# Altium schematic sheet CANBUS.SchDoc
size A3; SheetNumber: 11; SheetTotal: 11
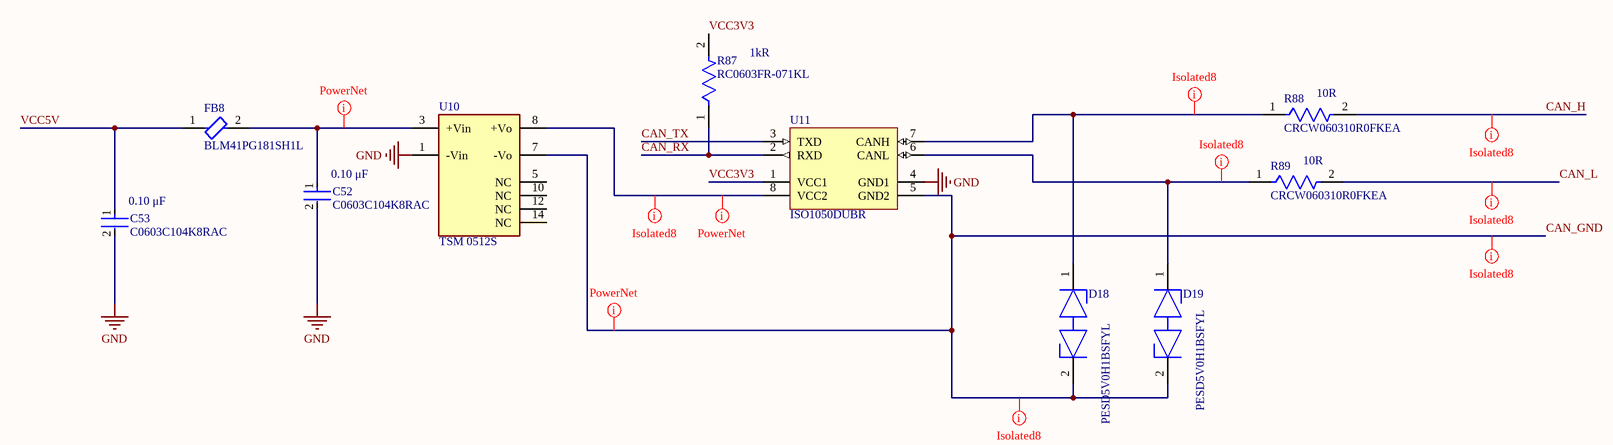
[diagram p0: CANBUS.SchDoc]

## Parts
C52  C0603C104K8RAC  Capacitance: 0.10 μF  [FP-C0603C-CF-MFG]
C53  C0603C104K8RAC  Capacitance: 0.10 μF  [FP-C0603C-CF-MFG]
D18  PESD5V0H1BSFYL  [FP-SOD962-2-MFG]
D19  PESD5V0H1BSFYL  [FP-SOD962-2-MFG]
FB8  BLM41PG181SH1L  [FP-BLM41-0_2-a1_2-MFG]
R87  RC0603FR-071KL  Resistance: 1kR  [FP-RC0603-0_55-IPC_C]
R88  CRCW060310R0FKEA  Resistance: 10R  [FP-CRCW0603-e3-IPC_A]
R89  CRCW060310R0FKEA  Resistance: 10R  [FP-CRCW0603-e3-IPC_A]
U10  TSM 0512S  [FP-TSM_0512S-MFG]
U11  ISO1050DUBR  [DUB0008A_L]

## Nets
GND: C52.2 C53.2 U10.1(-Vin) U11.4(GND1)
CAN_GND: D18.2(K2) D19.2(K2) U10.7(-Vo) U11.5(GND2)
CAN_H: R88.2
CAN_L: R89.2
CAN_RX: R87.1 U11.2(RXD)
CAN_TX: U11.3(TXD)
VCC3V3: R87.2 U11.1(VCC1)
VCC5V: C53.1 FB8.1
NetC52_1: C52.1 FB8.2 U10.3(+Vin)
NetD18_1: D18.1(K1) R88.1 U11.7(CANH)
NetD19_1: D19.1(K1) R89.1 U11.6(CANL)
NetU10_8: U10.8(+Vo) U11.8(VCC2)

Not connected (* = marked no-connect by the designer): U10 5(NC) 10(NC) 12(NC) 14(NC)

## Layout directives
net class Isolated8: CAN_GND, CAN_H, CAN_L, NetD18_1, NetD19_1, NetU10_8
net class Power: CAN_GND, NetC52_1, NetU10_8

## Library data of the parts
C52 C53 = CMP-03020-006081-2: C0603 0.10 μF X7R 30ppm/°C 10.00% 10 V; Manufacturer: KEMET; Value: 0.10 μF; Material: Ceramic; Automotive Grade: Grade 1; Voltage Rating: 10 V; Tolerance: 0.1; Automotive: Yes; Device Class L2: Capacitors; Height: 0.87mm; Temperature Range High: +125°C; Temperature Coefficient: 30ppm/°C; Temperature Range Low: -55°C; Package: C0603C-CF; Lead Free: Yes; Octopart: https://octopart.com/c0603c104k8rac-kemet-1325403; Manufacturer Part Number: C0603C104K8RAC; Temperature: -55°C to +125°C; Mouser Description: .1UF 10V 10% 0603; RoHS: TRUE; ComponentLink2URL: https://api.kemet.com/component-edge/download/datasheet/C0603C100J5GACAUTO.pdf; ComponentLink2Description: Datasheet; Temperature Characteristic: X7R; Device Class L1: Passive Components; Category: Cap; Device Class L3: Ceramic Capacitors
D18 D19 = CMP-14436-000004-1: TVS DIODE 5V 5V DSN0603-2; Manufacturer: Nexperia; Breakdown Voltage: 6V; Direction: Bidirectional; Value: 0.15pF; Clamping Voltage: 6.3V; Number Of Channels: 1; Peak Pulse Current: 7A; Max Junction Temp: +150°C; Lead Free: Yes; Reverse Standoff Voltage: 5V; Footprint Url: https://assets.nexperia.com/documents/outline-drawing/SOD962-2.pdf; ComponentLink2Description: Datasheet; Height: 0.32mm; Ambient Temperature Range Low: -40°C; Manufacturer Part Number: PESD5V0H1BSFYL; Octopart: https://octopart.com/pesd5v0h1bsfyl-nexperia-78741149; Ambient Temperature Range High: +125°C; RoHS: TRUE; Temperature: to +150°C; Capacitance: 0.15pF; ComponentLink2URL: https://assets.nexperia.com/documents/data-sheet/PESD5V0H1BSF.pdf; Temperature Range High: +150°C; Device Class L2: TVS Diodes; Digikey Description: TVS DIODE 5V 5V DSN0603-2; Category: Diode; Device Class L3: unset; Device Class L1: Circuit Protection; Package: SOD962-2; Automotive: No
FB8 = CMP-06046-002023-1: Ferrite Bead, 1806, 180Ω @ 100MHz, 25%, 0.02Ω, 3.5A; Impedance: 180R; Number of Lines: 1; Max DC Current: 50mA; DC Resistance (DCR): 20mR; Mount: Surface Mount; Length: 4.5mm; Tolerance: 25%; Series: EMIFIL®, BLM41P; Package Quantity: 2500; Min Operating Temperature: -55°C; Max Operating Temperature: 125°C; Height: 0.071inch; Packaging: Tape and Reel; Contact Plating: Tin; Test Frequency: 100MHz; Ratings: AEC-Q200; Case Code (Metric): 4516; Termination: SMD/SMT; Case Code (Imperial): 1806; Width: 0.063inch; Max Current Rating: 3.5A; Case/Package: 1806
R87 = CMP-1659-00009-5: RES 1K OHM 1% 1/10W 0603; Voltage Rating: 50V; Power Rating: 100mW; Temperature Coefficient: 100ppm/°C; Military Standard: Not; REACH SVHC: No SVHC; Size Code: 0603; Features: Moisture Resistant; Number of Terminations: 2; Technology: THICK FILM; Series: RC; Case Code (Metric): 1608; Resistance Tolerance: 1%; Resistor Type: Thick Film; Termination: SMD/SMT; Contact Plating: Tin; Radiation Hardening: No; Min Operating Temperature: -55°C; Max Operating Temperature: 155°C; Packaging: Tape and Reel; Max Power Dissipation: 100mW; RoHS Compliant: Yes; Height: 0.45mm; Lead Free: Lead Free; Case/Package: 0603; Length: 1.6mm; Tolerance: 1%; Case Code (Imperial): 0603; Construction: Rectangular; Depth: 0.8mm
R88 R89 = CMP-2000-03845-2: RES Thick Film, 10Ω, 1%, 0.1W, 100ppm/°C, 0603; Voltage Rating (DC): 75V; Power Rating: 100mW; Depth: 0.85mm; Height: 0.45mm; Package Quantity: 10; Temperature Coefficient: 100ppm/°C; Weight: 7.1E-05oz; Case Code (Metric): 1608; Number of Terminations: 2; Features: Automotive AEC-Q200; Termination: SMD/SMT; Lead Free: Lead Free; Mount: Surface Mount; Number of Pins: 2; Tolerance: 1%; Max Power Dissipation: 100mW; Width: 0.033inch; Contact Plating: Tin; Case Code (Imperial): 0603; Max Operating Temperature: 155°C; Min Operating Temperature: -55°C; Voltage Rating: 75V; Length: 1.55mm; Case/Package: 0603; Composition: Thick Film; Packaging: Tape and Reel; Military Standard: Not
U10 = CMP-49942-000007-1: DC DC CONVERTER 12V 960MW; Manufacturer: Tracopower; Nominal Supply Current: 110mA; Switching Topology: Boost; Min Supply Voltage: 4.5V; Switching Frequency: 100kHz; Output Type: Fixed; Standoff Height: 0mm; Number Of Outputs: 1; Output Current: 80mA; Max Supply Voltage: 5.5V; Octopart: https://octopart.com/tsm+0512s-tracopower-7394392; Manufacturer Part Number: TSM 0512S; ComponentLink2URL: https://docs.rs-online.com/a71b/0900766b816ed9c3.pdf; Lead Free: Yes; Temperature: -40°C to +85°C; Device Class L3: Voltage Regulators - Switching; Output Voltage: 12V; Temperature Range High: +85°C; Height: 7.55mm; RoHS: TRUE; Device Class L2: Power Management ICs; Digikey Description: DC DC CONVERTER 12V 960MW; ComponentLink2Description: Datasheet; Automotive: No; Category: IC; Temperature Range Low: -40°C; Device Class L1: Integrated Circuits (ICs); Package: 0
U11 = CMP-0315-00093-2: Isolated CAN Transceiver, -55 to 105 degC, 8-pin SOP (DUB), Green (RoHS & no Sb/Br); Manufacturer: Texas Instruments; Rating: Catalog; Isolated: Yes; Drivers Per Package: 1; PackageReference: DUB0008A; PartNumber: ISO1050DUBR; ComponentLink2Description: Package Specification; ComponentLink1Description: Datasheet; Mounting Technology: Surface Mount; ComponentLink1URL: http://www.ti.com/general/docs/lit/getliterature.tsp?genericPartNumber=ISO1050&fileType=pdf; ComponentLink2URL: http://www.ti.com/litv/pdf/mpds247b; Eco-Plan: Green (RoHS & no Sb/Br); PackageDescription: 8-Pin Small Outline Package 2.54 mm Pitch; PackageVersion: revC, May-2006; SubFamily: CAN; DatasheetVersion: SLLS983E